# EAGLE design softstart (EAGLE 9.6.2)
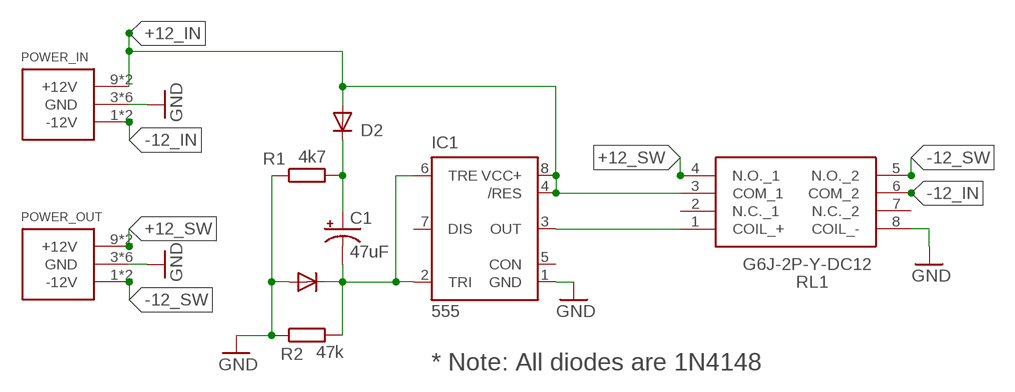
[diagram p0: schematic, sheet 1]

## Parts
C1  47uF  CPOL-USTT2D6  [TT2D6]
D1  1N4001  SMALL_DIODEDO35-7  [SMALL_DIODE]
D2  SMALL_DIODEDO35-7  [SMALL_DIODE]
IC1  555  555P  [DIP08]
POWER_IN  RUSS_EURORACK_POWER_SIMPLE10  [RUSS_EURORACK_POWER_10]
POWER_OUT  RUSS_EURORACK_POWER_SIMPLE10  [RUSS_EURORACK_POWER_10]
R1  4k7  RESISTOR7MM  [7MM_RESISTOR]
R2  47k  RESISTOR7MM  [7MM_RESISTOR]
RL1  G6J-2P-Y-DC12  [G6J2PYDC12]

## Nets
+12_IN: D2.A IC1.4(/RES) IC1.8(VCC+) POWER_IN.9(+12V) POWER_IN.10(+12V) RL1.3(COM_1)
+12_SW: POWER_OUT.9(+12V) POWER_OUT.10(+12V) RL1.4(N.O._1)
-12_IN: POWER_IN.1(-12V) POWER_IN.2(-12V) RL1.6(COM_2)
-12_SW: POWER_OUT.1(-12V) POWER_OUT.2(-12V) RL1.5(N.O._2)
GND: D1.A IC1.1(GND) POWER_IN.3(GND) POWER_IN.4(GND) POWER_IN.5(GND) POWER_IN.6(GND) POWER_IN.7(GND) POWER_IN.8(GND) POWER_OUT.3(GND) POWER_OUT.4(GND) POWER_OUT.5(GND) POWER_OUT.6(GND) POWER_OUT.7(GND) POWER_OUT.8(GND) R1.1 R2.1 RL1.8(COIL_-)
N$1: C1.+ D2.C R1.2
N$2: C1.- D1.C IC1.2(TRI) IC1.6(TRE) R2.2
N$3: IC1.3(OUT) RL1.1(COIL_+)
Unconnected: IC1.5(CON) IC1.7(DIS) RL1.2(N.C._1) RL1.7(N.C._2)

## Notes on the sheet
- * Note: All diodes are 1N4148

## Library data of the parts
C1 = rcl:CPOL-US: POLARIZED CAPACITOR, American symbol; SPICEPREFIX: C
D1 D2 = EURACK-MASTER-LIB:SMALL_DIODE: Small Signal Diode
IC1 = SparkFun-IC-Special-Function:555: General purpose bipolar Timer Datasheet <http://www.sparkfun.com/datasheets/Components/General/ne555.pdf> SparkFun Products SparkFun SparkPunk Sequencer Kit <https://www.sparkfun.com/products/12707> (KIT-12707) Storefront Component: 555 Timer <https://www.sparkfun.com/products/9273> (COM-09273) Two parts valid for production: VFP: IC-11930 (M7555 PTH) VFP: IC-09173 (555 PTH) - Preferred; PROD_ID: IC-09173; PROD_ID_ALT: IC-09173
POWER_IN POWER_OUT = ES-2144 LPF Module:RUSS_EURORACK_POWER_SIMPLE
R1 R2 = EURACK-MASTER-LIB:RESISTOR: Standard resistor on 7mm grid
RL1 = SamacSys_Parts:G6J-2P-Y-DC12: Low Signal Relays - PCB ThruHole NonLatching DPDT 12VDC 140mW Source: Datasheet <https://componentsearchengine.com/Datasheets/1/G6J-2P-Y-DC12.pdf>; DESCRIPTION: Low Signal Relays - PCB ThruHole NonLatching DPDT 12VDC 140mW; HEIGHT: 9.3mm; MANUFACTURER_NAME: Omron Electronics; MANUFACTURER_PART_NUMBER: G6J-2P-Y-DC12; MOUSER_PART_NUMBER: 653-G6J-2P-Y-DC12; MOUSER_PRICE-STOCK: https://www.mouser.co.uk/ProductDetail/Omron-Electronics/G6J-2P-Y-DC12?qs=kyocjfxn8IoDnT517tR9Nw%3D%3D

## Board
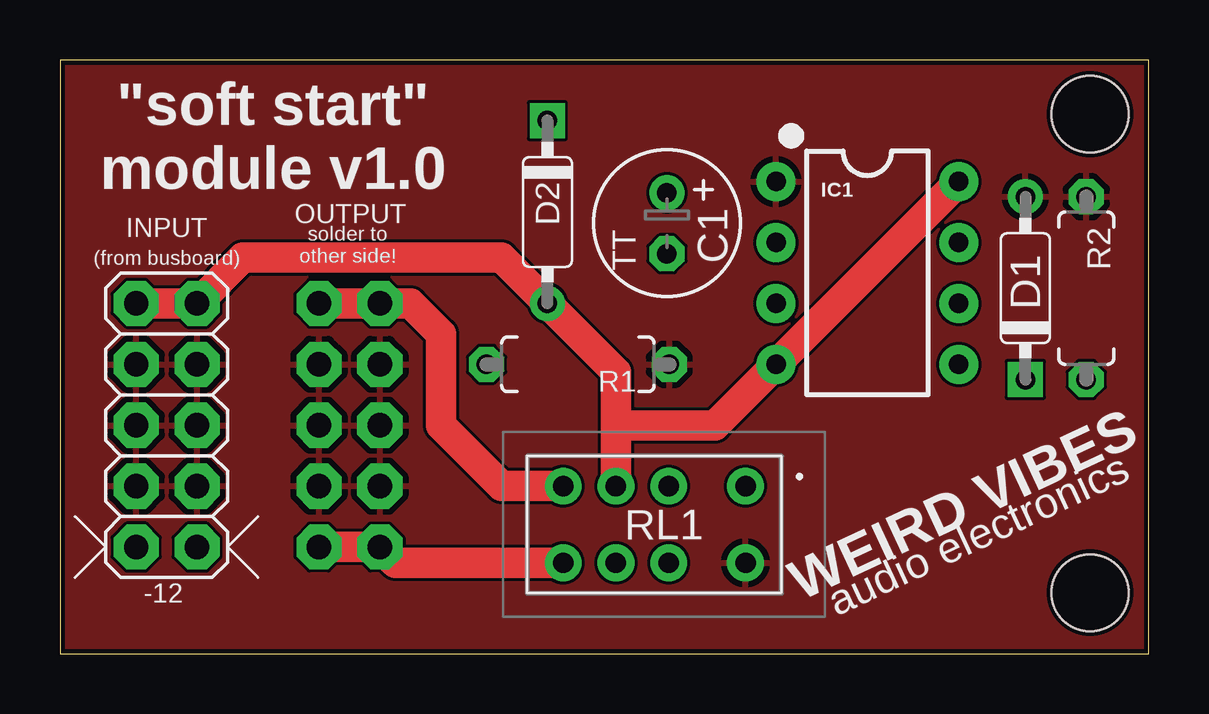
[diagram p1: board, top side]
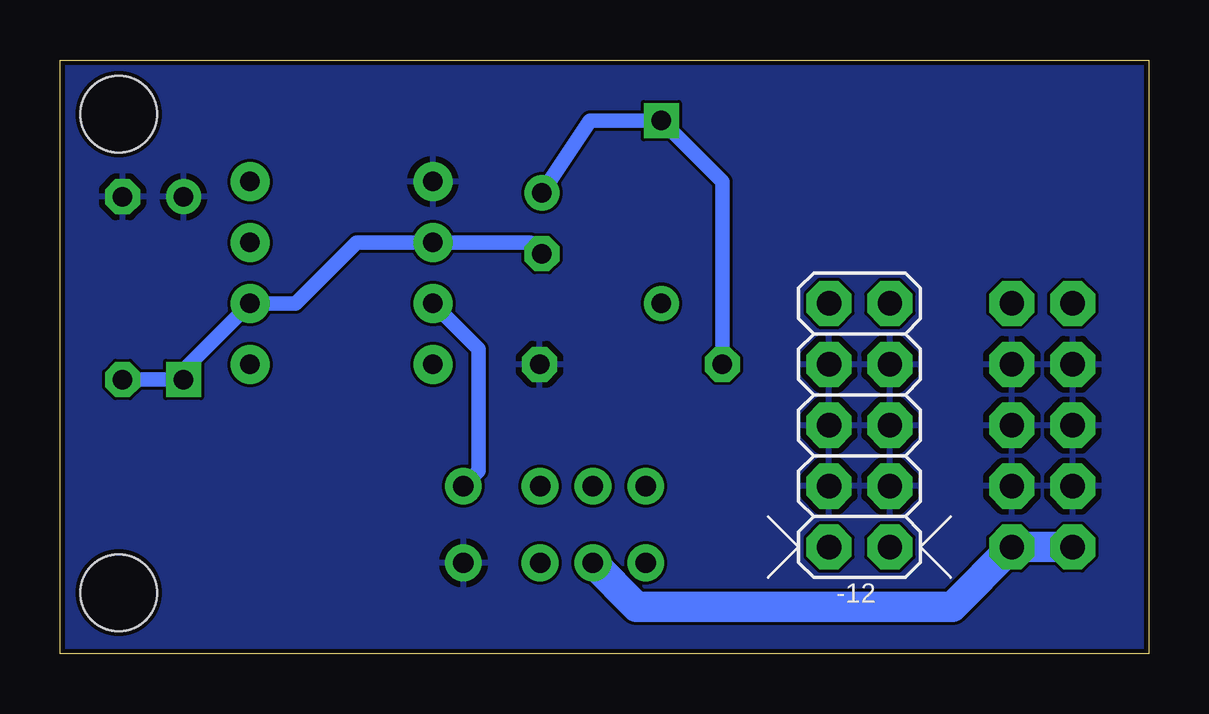
[diagram p2: board, bottom side, seen from below]

Size 45.39 x 24.76 mm. Coordinates in mm from the lower left corner, seen from the top.
Outline: 0,0 45.39,0 45.39,24.76 0,24.76 0,0
Copper layers (1*16): Top 0.035mm / dielectric 1.6mm / Bottom 0.035mm
Design rules "jlcpcb-2layers": minimum track width 5mil, minimum drill 0.3mm, track to track 5mil, track to pad 5mil, pad to pad 5mil, via to via 5mil, smd to smd 5mil, copper to edge 0.2mm, drill to drill 6mil, minimum pad ring 10mil, minimum via ring 3mil, stop-mask expansion 4mil, vias tented up to drill 0mil, thermal gap 10mil
Holes 3.2 mm at 42.94,2.54 42.94,22.5

### Footprints (pad centres in the part's own frame; a part is rotated, then mirrored left to right if it is on the bottom)
TT2D6 = drill 0.813: + -1.27,0 | drill 0.813 octagon: - 1.27,0
SMALL_DIODE = drill 0.813: A 3.81,0 | drill 0.813 square: C -3.81,0
DIP08 = drill 0.813 pad 1.626: 1 -3.81,-3.81; 2 -1.27,-3.81; 3 1.27,-3.81; 4 3.81,-3.81; 5 3.81,3.81; 6 1.27,3.81; 7 -1.27,3.81; 8 -3.81,3.81
RUSS_EURORACK_POWER_10 = drill 1.016 pad 1.88 octagon: 1 -5.08,-1.27; 2 -5.08,1.27; 3 -2.54,-1.27; 4 -2.54,1.27; 5 0,-1.27; 6 0,1.27; 7 2.54,-1.27; 8 2.54,1.27; 9 5.08,-1.27; 10 5.08,1.27
7MM_RESISTOR = drill 0.813 octagon: 1 -3.81,0; 2 3.81,0
G6J2PYDC12 = drill 0.85 pad 1.4: 1 0,0; 2 3.2,0; 3 5.4,0; 4 7.6,0; 5 7.6,3.2; 6 5.4,3.2; 7 3.2,3.2; 8 0,3.2

### Placement (x,y rotation side)
C1  25.3,17.95 270 top
D1  40.24,15.24 90 top
D2  20.32,18.41 270 top
IC1  33.66,15.88 270 top
POWER_IN  4.45,9.52 90 top
POWER_OUT  12.06,9.52 90 bottom
R1  21.59,12.07 180 top
R2  42.78,15.24 270 top
RL1  28.57,6.99 180 top

### Tracks (layer width: path | path; a pad name or v marks a point on that pad's centre or on a via)
+12_IN
  Top 1.27: POWER_IN.10 POWER_IN.9 7.62,16.51 18.41,16.51 D2.A 23.18,11.75 23.18,9.52 | IC1.8 IC1.4 27.3,9.52 23.18,9.52 | 23.18,9.52 RL1.3
+12_SW
  Top 1.27: RL1.4 18.41,6.99 15.88,9.52 15.88,12.07 15.88,13.34 14.61,14.61 POWER_OUT.10 POWER_OUT.9
-12_IN
  Bottom 1.27: POWER_IN.2 POWER_IN.1 8.2,1.96 21.35,1.96 RL1.6
-12_SW
  Top 1.27: RL1.5 13.99,3.79 POWER_OUT.2 POWER_OUT.1
GND
  pour Top: 0,-4.45 50.47,-4.45 50.47,24.77 0,24.77
  pour Bottom: 0,24.77 0,-5.08 50.47,-5.08 50.47,24.77
N$1
  Bottom 0.61: R1.2 17.78,19.69 D2.C 23.29,22.23 C1.+
N$2
  Bottom 0.61: R2.2 D1.C 40.24,11.83 IC1.6 35.56,14.61 33.02,17.14 IC1.2 25.77,17.14 C1.-
N$3
  Bottom 0.61: IC1.3 27.94,12.7 27.94,7.62 RL1.1

### Text on the board
tPlace: "soft start" / module v1.0 | OUTPUT | solder to / other side! | WEIRD VIBES | audio electronics